# EAGLE design LM358_VCO_smd (EAGLE 6.6.0)
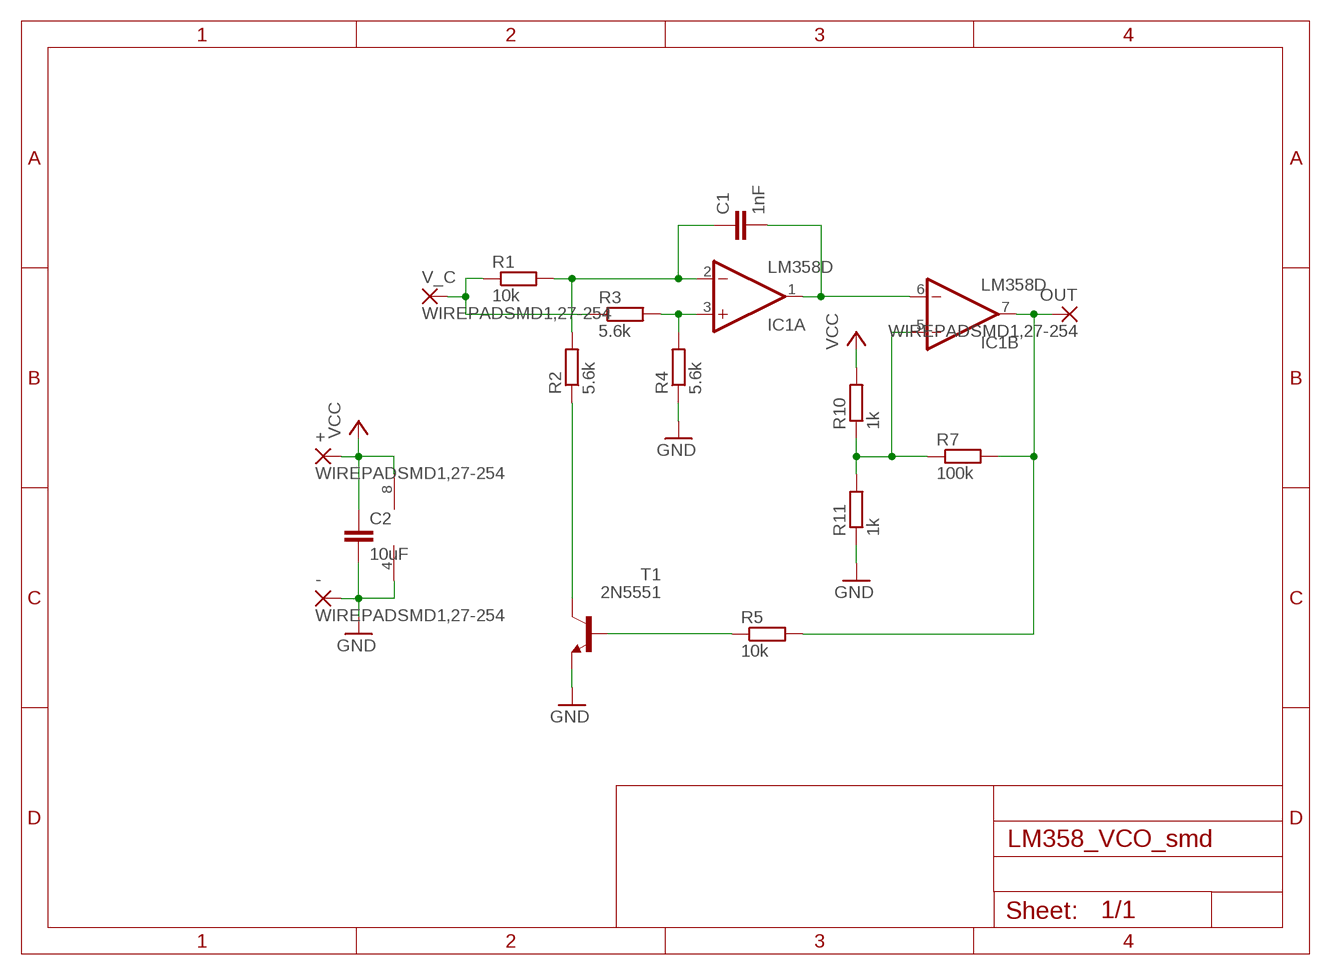
[diagram p0: schematic, sheet 1]

## Parts
+  WIREPADSMD1,27-254  [SMD1,27-2,54]
-  WIREPADSMD1,27-254  [SMD1,27-2,54]
C1  1nF  C-EUC0805  [C0805]
C2  10uF  C-EUC0805  [C0805]
IC1  LM358D  [SO08]
OUT  WIREPADSMD1,27-254  [SMD1,27-2,54]
R1  10k  R-EU_R0805  [R0805]
R2  5.6k  R-EU_R0805  [R0805]
R3  5.6k  R-EU_R0805  [R0805]
R4  5.6k  R-EU_R0805  [R0805]
R5  10k  R-EU_R0805  [R0805]
R7  100k  R-EU_R0805  [R0805]
R10  1k  R-EU_R0805  [R0805]
R11  1k  R-EU_R0805  [R0805]
T1  2N5551  MMBT5551LT1-NPN-SOT23-BEC  [SOT23-BEC]
V_C  WIREPADSMD1,27-254  [SMD1,27-2,54]

## Nets
GND: -.1(P) C2.2 IC1.4(P:V-) R4.1 R11.1 T1.E
N$1: IC1.3(A:+IN) R3.2 R4.2
N$2: C1.1 IC1.2(A:-IN) R1.2 R2.2
N$3: R1.1 R3.1 V_C.1(P)
N$4: R2.1 T1.C
N$5: C1.2 IC1.1(A:OUT) IC1.6(B:-IN)
N$6: R5.1 T1.B
N$7: IC1.7(B:OUT) OUT.1(P) R5.2 R7.2
N$8: IC1.5(B:+IN) R7.1 R10.1 R11.2
VCC: +.1(P) C2.1 IC1.8(P:V+) R10.2

## Library data of the parts
+ - OUT V_C = wirepad:WIREPAD: Wire PAD connect wire on PCB
C1 C2 = rcl:C-EU: CAPACITOR, European symbol
IC1 = linear:LM358: OP AMP also LM158; LM258; LM2904 Source: http://cache.national.com/ds/LM/LM158.pdf
R1-R5 R7 R10 R11 = rcl:R-EU_: RESISTOR, European symbol
T1 = transistor:*-NPN-: NPN Transistror BF959 corrected 2008.03.06

## Board
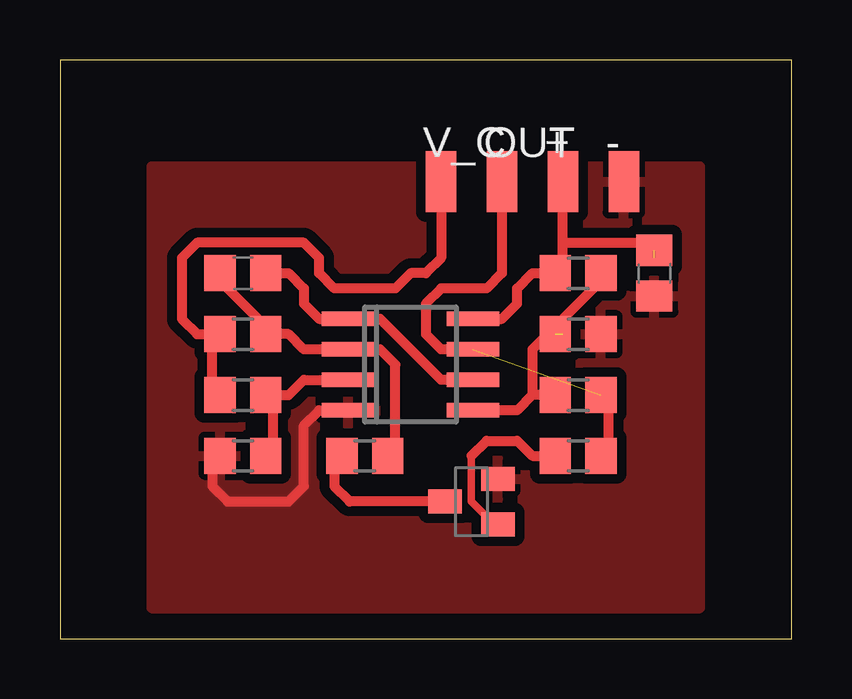
[diagram p1: board, top side]

Size 30.48 x 24.13 mm. Coordinates in mm from the lower left corner, seen from the top.
Outline: 0,0 30.48,0 30.48,24.13 0,24.13 0,0
Copper layers (1*16): Top 0.035mm / dielectric 1.5mm / Bottom 0.035mm
Design rules "default": minimum track width 10mil, minimum drill 24mil, track to track 8mil, track to pad 8mil, pad to pad 8mil, via to via 8mil, smd to smd 8mil, copper to edge 40mil, drill to drill 8mil, minimum pad ring 10mil, minimum via ring 8mil, stop-mask expansion 4mil, vias tented up to drill 0mil, thermal gap 10mil

### Footprints (pad centres in the part's own frame; a part is rotated, then mirrored left to right if it is on the bottom)
SMD1,27-2,54 = smd 1.27 x 2.54: 1 0,0
C0805 = smd 1.3 x 1.5: 1 -0.95,0; 2 0.95,0
SO08 = smd 0.6 x 2.2: 1 -1.905,-2.6; 2 -0.635,-2.6; 3 0.635,-2.6; 4 1.905,-2.6; 5 1.905,2.6; 6 0.635,2.6; 7 -0.635,2.6; 8 -1.905,2.6
R0805 = smd 1.3 x 1.5: 1 -0.95,0; 2 0.95,0
SOT23-BEC = smd 1 x 1.4: B -0.95,-1.1; C 0,1.1; E 0.95,-1.1

### Placement (x,y rotation side)
+  20.95,19.05 0 top
-  23.5,19.05 0 top
C1  7.62,15.24 0 top
C2  24.77,15.24 270 top
IC1  14.61,11.43 270 top
OUT  18.41,19.05 0 top
R1  7.62,12.7 0 top
R2  12.7,7.62 0 top
R3  7.62,10.16 0 top
R4  7.62,7.62 0 top
R5  21.59,7.62 0 top
R7  21.59,10.16 0 top
R10  21.59,15.24 180 top
R11  21.59,12.7 180 top
T1  17.14,5.71 90 top
V_C  15.88,19.05 0 top

### Tracks (layer width: path | path; a pad name or v marks a point on that pad's centre or on a via)
GND
  Top 0.406: R4.1 6.35,7.62 6.35,6.35 6.99,5.71 9.53,5.71 10.16,6.35 10.16,8.89 10.79,9.53 IC1.4
  pour Top (isolate 0.406): 3.81,1.27 26.67,1.27 26.67,19.68 3.81,19.68
N$1
  Top 0.406: R4.2 8.89,7.62 8.89,10.16 R3.2 9.53,10.16 10.16,10.79 IC1.3
N$2
  Top 0.406: C1.1 6.99,15.24 6.99,14.61 8.26,13.34 8.26,12.7 R1.2 9.53,12.7 10.16,12.06 IC1.2 13.34,12.06 13.97,11.43 13.97,7.62 R2.2
N$3
  Top 0.406: R1.1 6.35,12.7 | R3.1 6.35,10.16 6.35,12.7 | V_C.1 15.88,15.88 15.24,15.24 14.61,15.24 13.97,14.61 11.43,14.61 10.79,15.24 10.79,15.88 10.16,16.51 5.71,16.51 5.08,15.88 5.08,13.34 5.71,12.7 6.35,12.7
N$4
  Top 0.406: T1.C 12.06,5.71 11.43,6.35 11.43,7.62 R2.1
N$5
  Top 0.406: C1.2 9.53,15.24 10.16,14.61 10.16,13.97 10.79,13.34 IC1.1 13.34,13.34 15.88,10.79 IC1.6
N$6
  Top 0.305: 18.09,4.76 17.14,5.71 17.14,7.62
  Top 0.406: T1.B 18.09,4.76 | 17.14,7.62 17.78,8.26 19.05,8.26 19.68,7.62 R5.1
N$7  (1 unrouted)
  Top 0.406: IC1.7 15.88,12.06 15.24,12.7 15.24,13.97 15.88,14.61 17.78,14.61 18.41,15.24 OUT.1 | R5.2 22.86,7.62 22.86,9.84 R7.2
N$8  (1 unrouted)
  Top 0.406: 22.86,15.24 R10.1 22.23,15.24 22.23,14.61 20.95,13.34 20.95,12.7 | R11.2 20.32,12.7 19.68,12.06 19.68,10.16 | 19.68,10.16 19.05,9.53 IC1.5 | R7.1 19.68,10.16
VCC  (1 unrouted)
  Top 0.406: 16.51,13.34 IC1.8 18.41,13.34 19.05,13.97 19.05,14.61 19.68,15.24 R10.2 20.95,15.24 20.95,16.51 | 20.95,16.51 +.1 | 20.95,16.51 24.13,16.51 24.77,15.88